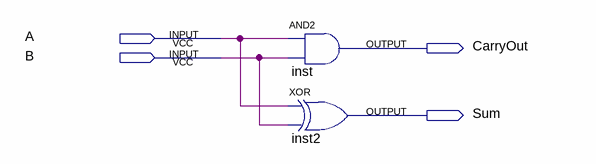
[diagram p0: schematic sheet]
// Quartus schematic HalfAdder.bdf as structural Verilog: 2 symbols, 4 pins
module HalfAdder (
  input  A,
  input  B,
  output CarryOut,
  output Sum
);

  and inst (CarryOut, A, B);
  xor inst2 (Sum, A, B);
endmodule
